# EAGLE design receiver (EAGLE 6.2)
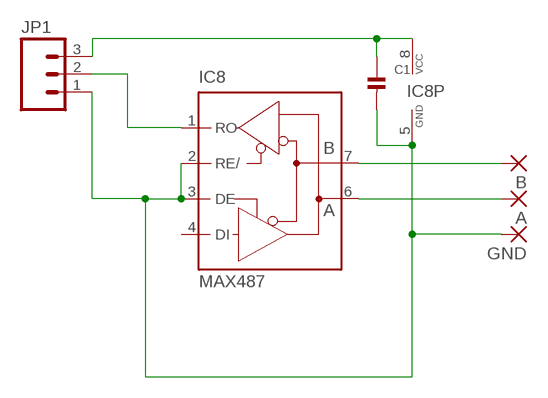
[diagram p0: schematic, sheet 1]

## Parts
A  SMD5  [SMD2,54-5,08]
B  SMD5  [SMD2,54-5,08]
C1  CAP_CERAMIC0805  [0805]
GND  SMD5  [SMD2,54-5,08]
IC8  MAX487  MAX481CSA  [SO08]
JP1  M03PTH  [1X03]

## Nets
5V: C1.1 IC8.8(VCC) JP1.3
GND_USB: C1.2 GND.1(P) IC8.2(RE/) IC8.3(DE) IC8.5(GND) JP1.1
N$5: B.1(P) IC8.7(B)
N$6: A.1(P) IC8.6(A)
TX: IC8.1(RO) JP1.2
Unconnected: IC8.4(DI)

## Library data of the parts
A B GND = wirepad:SMD5: SMD PAD
C1 = microbuilder:CAP_CERAMIC: Ceramic Capacitors 0402 - 0402 Surface Mount Capacitors 16pF 50V 5% [Digikey: 445-4899-2-ND] 18pF 50V 5% [Digikey: 490-1281-2-ND] 22pF 50V 5% [Digikey: 490-1283-2-ND] 68pF 50V 5% [Digikey: 490-1289-2-ND] 0.1uF 10V 10% [Digikey: 490-1318-2-ND] 1.0uF 6.3V 10% [Digikey: 490-1320-2-ND] 0603 - 0603 Surface Mount Capacitors 16 pF 50V 5% [Digikey: 445-5051-2-ND] 22 pF 50V [Digikey: PCC220ACVTR-ND] 33 pF 50V 5% [Digikey: 490-1415-1-ND] 56pF 50V 5% [Digikey: 490-1421-1-ND] 220pF 50V 5% [Digikey: 445-1285-1-ND] 680 pF 50V 2200 pF 50V 5% C0G [Digikey: 445-1297-1-ND] 5600 pF 100V 5% X7R [Digikey: 478-3711-1-ND] 0.1 µF 25V 10% [Digikey: PCC2277TR-ND] 0.22 µF 16V 10% X7R [Digikey: 445-1318-1-ND] 1.0 µF 25V 10% [Digikey: 445-5146-2-ND] 0603 - RF Specific 3pF 250V +/-0.1pF RF [Digikey: 712-1347-1-ND] 18 pF 250V 5% [Digikey: 478-3505-1-ND or 712-1322-1-ND] 56 pF 250V 5% C0G RF [Digikey: 490-4867-1-ND] 68 pF 250V RF [Digikey: 490-4868-1-ND] 0805 - 0805 Surface Mount Capacitors 220 pF 250V 2% RF Ceramic Capacitor [Digikey: 712-1398-1-ND] 1000 pF 50V 2% NP0 Ceramic Capacitor [Digikey: 478-3760-1-ND] 0.1 µF 25V 10% Ceramic Capacitor [Digikey: PCC1828TR-ND] 1.0 µF 16V 10% Ceramic Capacitor[Digikey: 490-1691-2-ND] 10.0 µF 10V 10% Ceramic Capacitor[Digikey: 709-1228-1-ND] 10.0 uF 16V 10% Ceramic Capacitor [Digikey: 478-5165-2-ND] 47 uF 6.3V 20% Ceramic Capacitor [Digikey: 587-1779-1-ND or 399-5506-1-ND] 1206 - 1206 Surface Mount Capacitors 47uF 10V 20% Ceramic Capacitor [Digikey: 490-5528-1-ND or 399-5508-1-ND or 445-6010-1-ND] 100uF 6.3V -20%, +80% Y5V Ceramic Capacitor (Digikey: 490-4512-1-ND, Mouser: 81-GRM31CF50J107ZE1L)
IC8 = maxim:MAX481CSA: RS485 TRANSEIVER; MF: MAXIM; MPN: MAX481CSA; OC_FARNELL: unknown; OC_NEWARK: 90C3817
JP1 = SparkFun-Connectors:M03: Header 3 Standard 3-pin 0.1" header. Use with straight break away headers (SKU : PRT-00116), right angle break away headers (PRT-00553), swiss pins (PRT-00743), machine pins (PRT-00117), and female headers (PRT-00115). Molex polarized connector foot print use with SKU : PRT-08232 with associated crimp pins and housings.

## Board
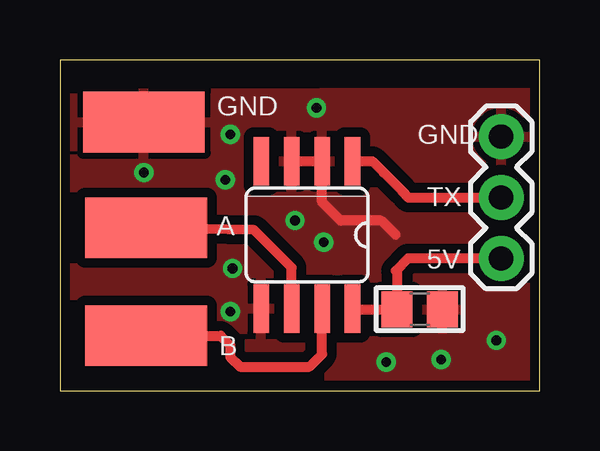
[diagram p1: board, top side]
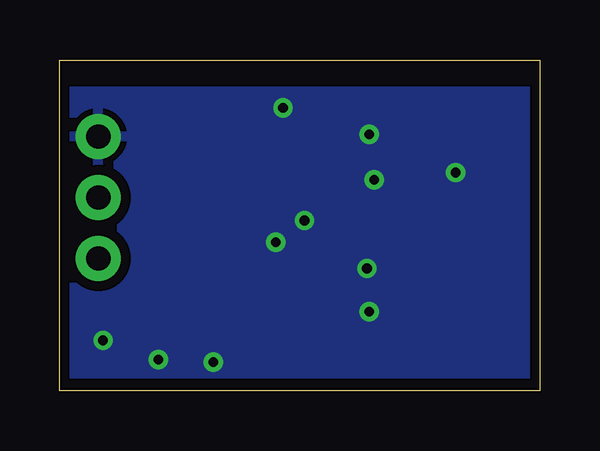
[diagram p2: board, bottom side, seen from below]

Size 20 x 13.8 mm. Coordinates in mm from the lower left corner, seen from the top.
Outline: 0,0 20,0 20,13.8 0,13.8 0,0
Copper layers (1*16): Top 0.035mm / dielectric 1.5mm / Bottom 0.035mm
Design rules: minimum track width 0.2mm, minimum drill 0.4mm, track to track 0.2mm, track to pad 0.2mm, pad to pad 0.2mm, via to via 0.2mm, smd to smd 0mil, copper to edge 0.4mm, drill to drill 8mil, minimum pad ring 0.3mm, minimum via ring 8mil, stop-mask expansion 4mil, vias tented up to drill 40mil, thermal gap 10mil

### Footprints (pad centres in the part's own frame; a part is rotated, then mirrored left to right if it is on the bottom)
SMD2,54-5,08 = smd 2.54 x 5.08: 1 0,0
0805 = smd 1.3 x 1.5: 1 -0.95,0; 2 0.95,0
SO08 = smd 0.66 x 2.032: 1 -1.905,-3.073; 2 -0.635,-3.073; 3 0.635,-3.073; 4 1.905,-3.073; 5 1.905,3.073; 6 0.635,3.073; 7 -0.635,3.073; 8 -1.905,3.073
1X03 = drill 1.016 pad 1.88: 1 0,0; 2 2.54,0; 3 5.08,0

### Placement (x,y rotation side)
A  3.6,6.8 90 top
B  3.6,2.3 90 top
C1  15,3.4 0 top
GND  3.5,11.2 90 top
IC8  10.3,6.5 180 top
JP1  18.4,10.6 270 top

### Tracks (layer width: path | path; a pad name or v marks a point on that pad's centre or on a via)
5V
  Top 0.406: JP1.3 14.52,5.52 14,5 14.05,4.95 C1.1 12.23,3.4 IC8.8
GND_USB  (via drill 0.4)
  Top 0.406: IC8.3 IC8.2 10.93,7.87 11.1,7.7 11.7,7.1 13.4,7.1 14,6.5
  other vias: 6.9,8.8 3.5,9.1 9.8,7.1 11,6.2 7.1,10.7 7.1,3.3 7.2,5.1 10.7,11.8 13.6,1.2 15.9,1.3 18.2,2.1
  pour Bottom (isolate 0.406): 0.5,0.7 51.9,0.7 51.8,12.5 0.5,12.5
  pour Top (isolate 0.406): 0.6,0.6 51.9,0.7 51.8,12.5 0.6,12.4
N$5
  Top 0.406: B.1 6.7,2.3 7.1,1.9 7.1,1.4 7.5,1 10.4,1 10.9,1.5 10.93,1.53 IC8.7
N$6
  Top 0.406: IC8.6 9.66,5.14 8.9,5.9 8.1,6.7 A.1
TX
  Top 0.406: IC8.1 13.03,9.57 13.5,9.1 14.28,8.33 14.54,8.06 JP1.2

### Text on the board
tPlace: GND | TX | 5V